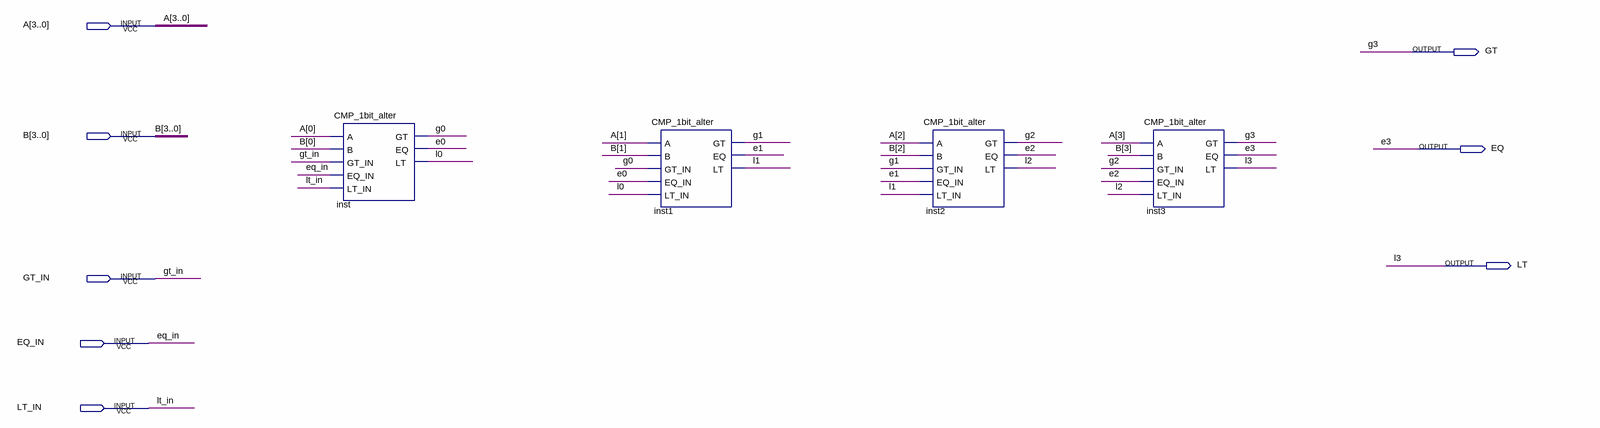
[diagram p0: schematic sheet]
// Quartus schematic cmp_4bit.bdf as structural Verilog: 4 symbols, 8 pins
module cmp_4bit (
  input  [3:0] A,
  input  [3:0] B,
  input  GT_IN,
  input  EQ_IN,
  input  LT_IN,
  output GT,
  output EQ,
  output LT
);

  wire e0, e1, e2, g0, g1, g2, l0, l1, l2;

  CMP_1bit_alter inst (.A(A[0]), .B(B[0]), .GT_IN(GT_IN), .EQ_IN(EQ_IN), .LT_IN(LT_IN), .GT(g0), .EQ(e0), .LT(l0));
  CMP_1bit_alter inst1 (.A(A[1]), .B(B[1]), .GT_IN(g0), .EQ_IN(e0), .LT_IN(l0), .GT(g1), .EQ(e1), .LT(l1));
  CMP_1bit_alter inst2 (.A(A[2]), .B(B[2]), .GT_IN(g1), .EQ_IN(e1), .LT_IN(l1), .GT(g2), .EQ(e2), .LT(l2));
  CMP_1bit_alter inst3 (.A(A[3]), .B(B[3]), .GT_IN(g2), .EQ_IN(e2), .LT_IN(l2), .GT(GT), .EQ(EQ), .LT(LT));

  // Other names for the same wires on the sheet: e3 = EQ; g3 = GT; l3 = LT
endmodule
